# EAGLE schematic H Driver (EAGLE 8.3.2)
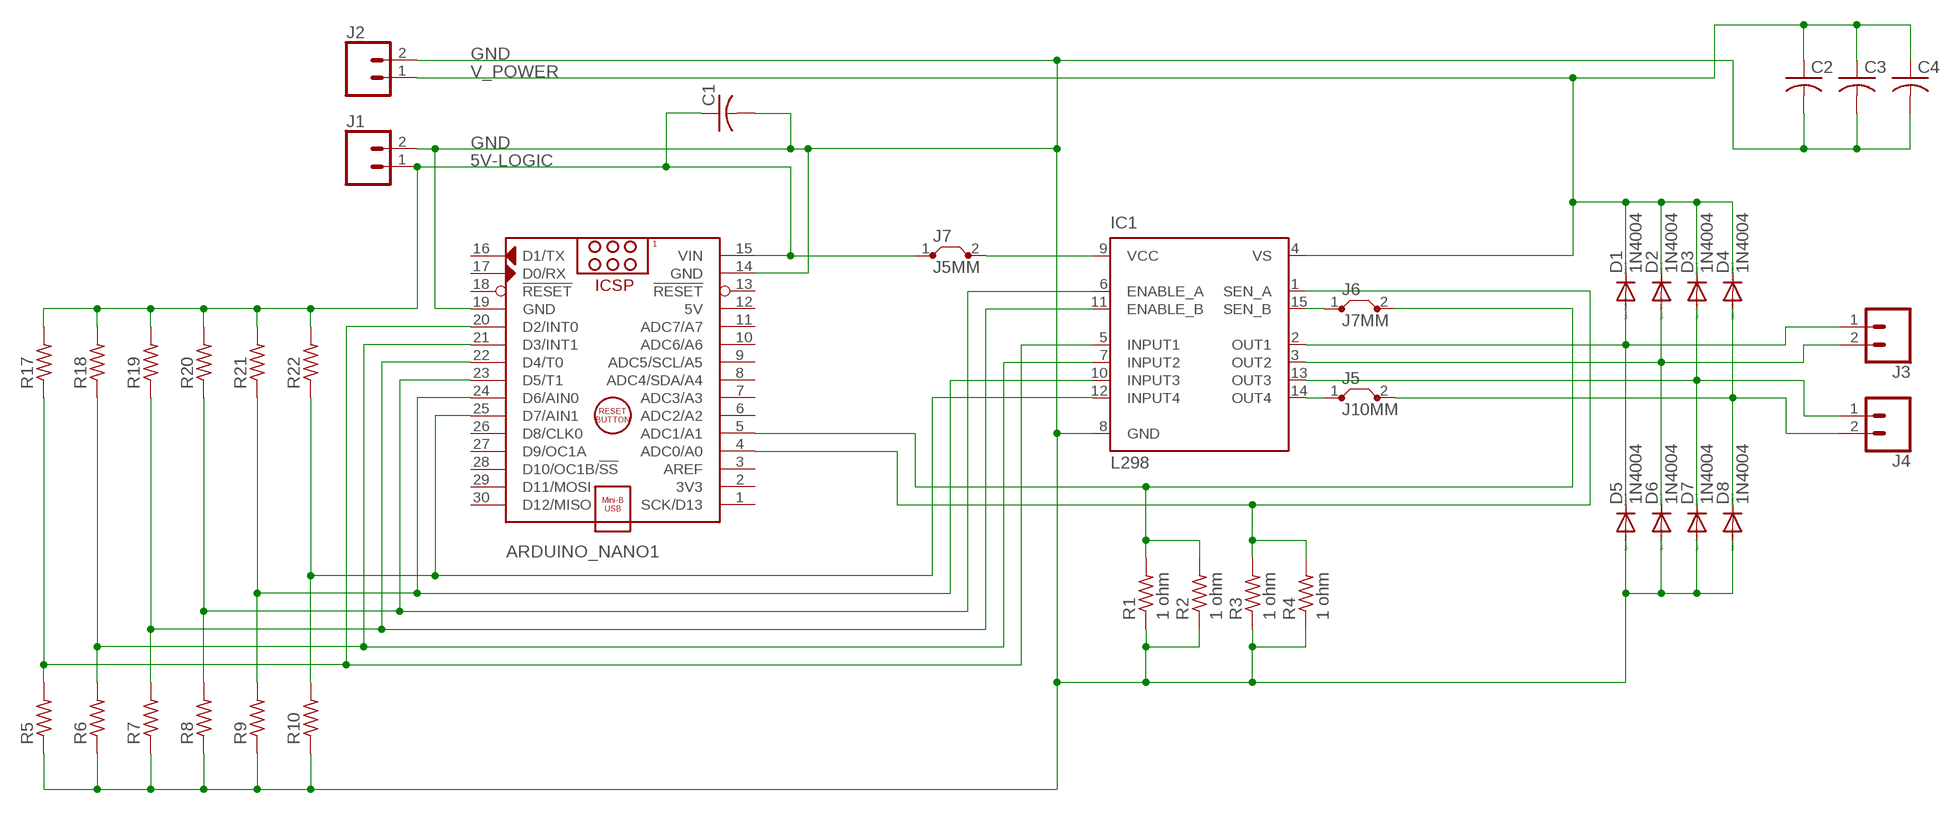
[diagram p0: schematic, sheet 1]

## Parts
ARDUINO_NANO1  ARDUINO_NANO  [ARDUINO_NANO]
C1  C-US050-025X075  [C050-025X075]
C2  C-US050-025X075  [C050-025X075]
C3  C-US050-025X075  [C050-025X075]
C4  C-US050-025X075  [C050-025X075]
D1  1N4004  [DO41-10]
D2  1N4004  [DO41-10]
D3  1N4004  [DO41-10]
D4  1N4004  [DO41-10]
D5  1N4004  [DO41-10]
D6  1N4004  [DO41-10]
D7  1N4004  [DO41-10]
D8  1N4004  [DO41-10]
IC1  L298  [MULTIWATT-15]
J1  CONN_023.5MM_LOCK  [SCREWTERMINAL-3.5MM-2_LOCK]
J2  CONN_023.5MM_LOCK  [SCREWTERMINAL-3.5MM-2_LOCK]
J3  CONN_023.5MM_LOCK  [SCREWTERMINAL-3.5MM-2_LOCK]
J4  CONN_023.5MM_LOCK  [SCREWTERMINAL-3.5MM-2_LOCK]
J5  J10MM  [10]
J6  J7MM  [07]
J7  J5MM  [05]
R1  1 ohm  R-US_0204/7  [0204/7]
R2  1 ohm  R-US_0204/7  [0204/7]
R3  1 ohm  R-US_0204/7  [0204/7]
R4  1 ohm  R-US_0204/7  [0204/7]
R5  R-US_0204/7  [0204/7]
R6  R-US_0204/7  [0204/7]
R7  R-US_0204/7  [0204/7]
R8  R-US_0204/7  [0204/7]
R9  R-US_0204/7  [0204/7]
R10  R-US_0204/7  [0204/7]
R17  R-US_0204/7  [0204/7]
R18  R-US_0204/7  [0204/7]
R19  R-US_0204/7  [0204/7]
R20  R-US_0204/7  [0204/7]
R21  R-US_0204/7  [0204/7]
R22  R-US_0204/7  [0204/7]

## Nets
5V-LOGIC: ARDUINO_NANO1.15(VIN) C1.1 J1.1 J7.1 R17.2 R18.2 R19.2 R20.2 R21.2 R22.2
GND: ARDUINO_NANO1.14(GND) ARDUINO_NANO1.19(GND) C1.2 C2.2 C3.2 C4.2 D5.A D6.A D7.A D8.A IC1.8(GND) J1.2 J2.2 R1.1 R2.1 R3.1 R4.1 R5.1 R6.1 R7.1 R8.1 R9.1 R10.1
N$3: ARDUINO_NANO1.4(ADC0/A0) IC1.1(SEN_A) R3.2 R4.2
N$4: ARDUINO_NANO1.25(D7/AIN1) IC1.12(INPUT4) R10.2 R22.1
N$5: ARDUINO_NANO1.24(D6/AIN0) IC1.10(INPUT3) R9.2 R21.1
N$6: ARDUINO_NANO1.23(D5/T1) IC1.6(ENABLE_A) R8.2 R20.1
N$7: ARDUINO_NANO1.22(D4/T0) IC1.11(ENABLE_B) R7.2 R19.1
N$8: ARDUINO_NANO1.21(D3/INT1) IC1.7(INPUT2) R6.2 R18.1
N$9: ARDUINO_NANO1.20(D2/INT0) IC1.5(INPUT1) R5.2 R17.1
N$10: D4.A D8.C J4.2 J5.2
N$11: D3.A D7.C IC1.13(OUT3) J4.1
N$12: D2.A D6.C IC1.3(OUT2) J3.2
N$13: D1.A D5.C IC1.2(OUT1) J3.1
N$14: ARDUINO_NANO1.5(ADC1/A1) J6.2 R1.2 R2.2
N$15: IC1.15(SEN_B) J6.1
N$16: IC1.9(VCC) J7.2
N$19: IC1.14(OUT4) J5.1
V_POWER: C2.1 C3.1 C4.1 D1.C D2.C D3.C D4.C IC1.4(VS) J2.1
Unconnected: ARDUINO_NANO1.1(SCK/D13) ARDUINO_NANO1.2(3V3) ARDUINO_NANO1.3(AREF) ARDUINO_NANO1.6(ADC2/A2) ARDUINO_NANO1.7(ADC3/A3) ARDUINO_NANO1.8(ADC4/SDA/A4) ARDUINO_NANO1.9(ADC5/SCL/A5) ARDUINO_NANO1.10(ADC6/A6) ARDUINO_NANO1.11(ADC7/A7) ARDUINO_NANO1.13(!RESET) ARDUINO_NANO1.16(D1/TX) ARDUINO_NANO1.17(D0/RX) ARDUINO_NANO1.18(!RESET) ARDUINO_NANO1.26(D8/CLK0) ARDUINO_NANO1.27(D9/OC1A) ARDUINO_NANO1.28(D10/OC1B/!SS) ARDUINO_NANO1.29(D11/MOSI) ARDUINO_NANO1.30(D12/MISO)

## Power pins joined to a net without a drawn wire
5V: ARDUINO_NANO1.12(5V)

## Library data of the parts
ARDUINO_NANO1 = ArduinoNanoV30:ARDUINO_NANO: Arduino Nano V3.0 Module Overview: The Arduino Nano is a small, complete, and breadboard-friendly board based on the ATmega328 (Arduino Nano 3.x) or ATmega168 (Arduino Nano 2.x). It has more or less the same functionality of the Arduino Duemilanove, but in a different package. It lacks only a DC power jack, and works with a Mini-B USB cable instead of a standard one. The Nano was designed and is being produced by Gravitech <http://www.gravitech.us/arna30wiatp.html>. General specifications: Item Value Microcontroller Atmel ATmega168 or ATmega328 Operating Voltage (logic level) 5 V Input Voltage (recommended) 7-12 V Input Voltage (limits) 6-20 V Digital I/O Pins 14 (of which 6 provide PWM output) Analog Input Pins 8 DC Current per I/O Pin 40 mA Flash Memory 16 KB (ATmega168) or 32 KB (ATmega328) of which 2 KB used by bootloader SRAM 1 KB (ATmega168) or 2 KB (ATmega328) EEPROM 512 bytes (ATmega168) or 1 KB (ATmega328) Clock Speed 16 MHz Dimensions (Inches) 0.73" x 1.70" Dimensions (mm) 18mm x 45mm Overall height About 9 mm (not including pins) Weigth 5 g Power: The Arduino Nano can be powered via the Mini-B USB connection, 6-20V unregulated external power supply (pin 30), or 5V regulated external power supply (pin 27). The power source is automatically selected to the highest voltage source. Memory: The ATmega168 has 16 KB of flash memory for storing code (of which 2 KB is used for the bootloader); the ATmega328 has 32 KB, (also with 2 KB used for the bootloader). The ATmega168 has 1 KB of SRAM and 512 bytes of EEPROM (which can be read and written with the EEPROM library); the ATmega328 has 2 KB of SRAM and 1 KB of EEPROM. Input and Output: Each of the 14 digital pins on the Nano can be used as an input or output, using pinMode(), digitalWrite(), and digitalRead() functions. They operate at 5 volts. Each pin can provide or receive a maximum of 40 mA and has an internal pull-up resistor (disconnected by default) of 20-50 kOhms. In addition, some pins have specialized functions. Visit Arduino - ArduinoBoardNano <https://www.arduino.cc/en/Main/ArduinoBoardNano>
C1-C4 = rcl:C-US: CAPACITOR, American symbol
D1-D8 = diode:1N4004: DIODE general purpose rectifier, 1 A
IC1 = st-microelectronics:L298: DUAL FULL-BRIDGE DRIVER; MPN: L298N; OC_FARNELL: 1589425; OC_NEWARK: 32M1527
J1-J4 = SparkFun-Connectors:CONN_02: Multi connection point. Often used as Generic Header-pin footprint for 0.1 inch spaced/style header connections On any of the 0.1 inch spaced packages, you can populate with these: Break Away Headers - Straight <https://www.sparkfun.com/products/116> (PRT-00116) Break Away Male Headers - Right Angle <https://www.sparkfun.com/products/553> (PRT-00553) Female Headers <https://www.sparkfun.com/products/115> (PRT-00115) Break Away Headers - Machine Pin <https://www.sparkfun.com/products/117> (PRT-00117) Break Away Female Headers - Swiss Machine Pin <https://www.sparkfun.com/products/743> (PRT-00743) For SCREWTERMINALS and SPRING TERMINALS visit here: Screw Terimnals on SparkFun.com <https://www.sparkfun.com/search/results?term=Screw+Terminals> (5mm/3.5mm/2.54mm spacing) This device is also useful as a general connection point to wire up your design to another part of your project. Our various solder wires solder well into these plated through hole pads. Hook-Up Wire - Assortment (Stranded, 22 AWG) <https://www.sparkfun.com/products/11375> (PRT-11375) Hook-Up Wire - Assortment (Solid Core, 22 AWG) <https://www.sparkfun.com/products/11367> (PRT-11367) View the entire wire category on our website here <https://www.sparkfun.com/categories/141> Special notes: Molex polarized connector foot print use with: PRT-08233 with associated crimp pins and housings. 2.54_SCREWTERM for use with PRT-10571. 3.5mm Screw Terminal footprints for PRT-08084 5mm Screw Terminal footprints for use with PRT-08432; PROD_ID: CONN-08399
J5-J7 = jumper:J: Bridge
R1-R10 R17-R22 = rcl:R-US_: RESISTOR, American symbol